# Altium schematic sheet Motor Driver.SchDoc
size A4; PageSetup: Record=PageOptions|CenterHorizontal=True|CenterVertical=True|PrintScale=0.98|XCorrection=1.00|YCorrection=1.00|PrintKind=2|BorderSize=5000000|LeftOffset=0|BottomOffset=0|Orientation=2|PaperLength=1000|PaperWidth=1000|Scale=100|PaperSource=7|PrintQuality=-4|MediaType=1|DitherType=10|PaperKind=A4|PrintScaleMode=1; DrawnBy: HENRIQUE THIESEN; Organization: Altium Limited; Address1: L3, 12a Rodborough Rd; Address2: Frenchs Forest; Address3: NSW; Address4: Australia 2086; DocumentNumber: 3; SheetNumber: 3; SheetTotal: 9; Project: WEG AirCon DAQ Adapter
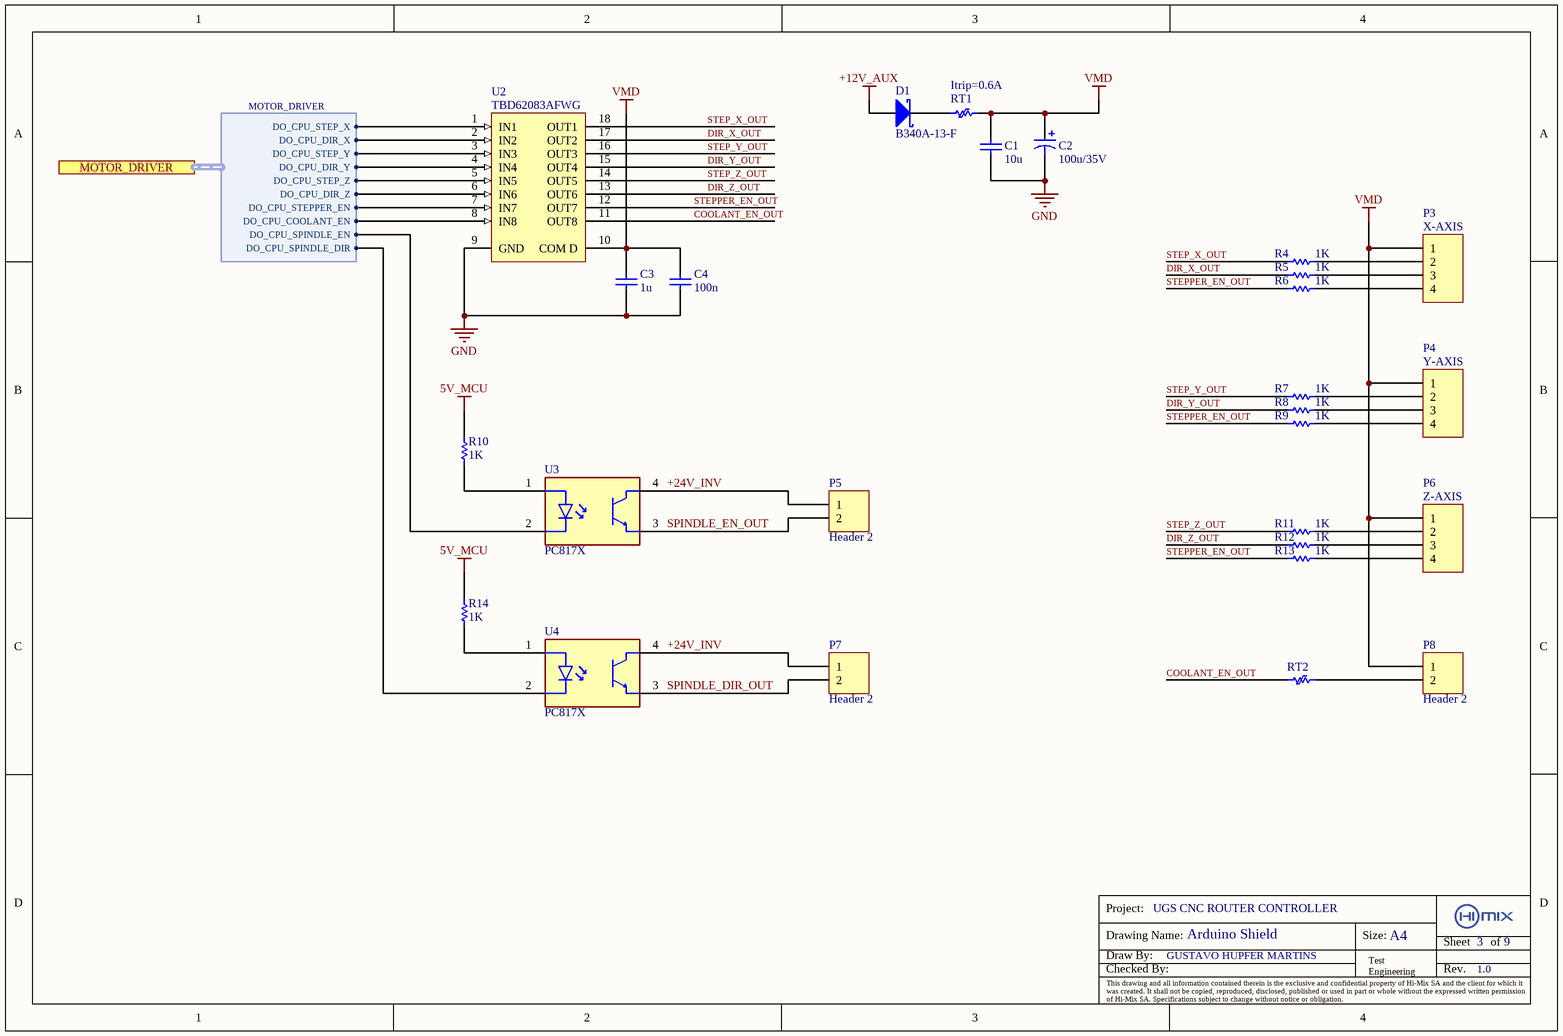
[diagram p0: Motor Driver.SchDoc]

## Parts
C1  value 10u  [SMT1210_M]  (hidden comment: X7R/1210/50V)
C2  value 100u/35V  [FKV Panasonic 8x10.2L (F)]  (hidden comment: 8x10.2)
C3  value 1u  [SMT0805_N]  (hidden comment: X7R/0805/50V)
C4  value 100n  [SMT0603_N]  (hidden comment: X7R/0603/50V)
D1  B340A-13-F  [SMB]
P3  Desc.: X-AXIS  [HDR1X4]
P4  Desc.: Y-AXIS  [HDR1X4]
P5  Header 2  [HDR1X2]
P6  Desc.: Z-AXIS  [HDR1X4]
P7  Header 2  [HDR1X2]
P8  Header 2  [HDR1X2]
R4  value 1K  [SMT1210_M]  (hidden comment: 1210/.5W/1Q)
R5  value 1K  [SMT1210_M]  (hidden comment: 1210/.5W/1Q)
R6  value 1K  [SMT1210_M]  (hidden comment: 1210/.5W/1Q)
R7  value 1K  [SMT1210_M]  (hidden comment: 1210/.5W/1Q)
R8  value 1K  [SMT1210_M]  (hidden comment: 1210/.5W/1Q)
R9  value 1K  [SMT1210_M]  (hidden comment: 1210/.5W/1Q)
R10  value 1K  [SMT1210_M]  (hidden comment: 1210/.5W/1Q)
R11  value 1K  [SMT1210_M]  (hidden comment: 1210/.5W/1Q)
R12  value 1K  [SMT1210_M]  (hidden comment: 1210/.5W/1Q)
R13  value 1K  [SMT1210_M]  (hidden comment: 1210/.5W/1Q)
R14  value 1K  [SMT1210_M]  (hidden comment: 1210/.5W/1Q)
RT1  Itrip=0.6A  [AXIAL-0.2]
RT2  Poly Switch  [AXIAL-0.2]  (value not drawn)
U2  TBD62083AFWG  [SOIC18]
U3  PC817X  [DIP-4]
U4  PC817X  [DIP-4]

## Ports
MOTOR_DRIVER (harness MOTOR_DRIVER)

## Harnesses
MOTOR_DRIVER: DO_CPU_STEP_X, DO_CPU_STEP_Y, DO_CPU_STEP_Z, DO_CPU_DIR_X, DO_CPU_DIR_Y, DO_CPU_DIR_Z, DO_CPU_STEPPER_EN, DO_CPU_COOLANT_EN, DO_CPU_SPINDLE_EN, DO_CPU_SPINDLE_DIR

## Nets
5V_MCU: R10.1 R14.1
+12V_AUX: D1.1(A)
GND: C1.1 C2.2 C3.1 C4.1 U2.9(GND)
VMD: C1.2 C2.1 C3.2 C4.2 P3.1 P4.1 P6.1 P8.1 RT1.1 U2.10(COM_D)
+24V_INV: P5.1 P7.1 U3.4(C) U4.4(C)
COOLANT_EN_OUT: RT2.1 U2.11(OUT8)
DIR_X_OUT: R5.1 U2.17(OUT2)
DIR_Y_OUT: R8.1 U2.15(OUT4)
DIR_Z_OUT: R12.1 U2.13(OUT6)
SPINDLE_DIR_OUT: P7.2 U4.3(E)
SPINDLE_EN_OUT: P5.2 U3.3(E)
STEP_X_OUT: R4.1 U2.18(OUT1)
STEP_Y_OUT: R7.1 U2.16(OUT3)
STEP_Z_OUT: R11.1 U2.14(OUT5)
STEPPER_EN_OUT: R6.1 R9.1 R13.1 U2.12(OUT7)
NetD1_2: D1.2(K) RT1.2
NetP3_2: P3.2 R4.2
NetP3_3: P3.3 R5.2
NetP3_4: P3.4 R6.2
NetP4_2: P4.2 R7.2
NetP4_3: P4.3 R8.2
NetP4_4: P4.4 R9.2
NetP6_2: P6.2 R11.2
NetP6_3: P6.3 R12.2
NetP6_4: P6.4 R13.2
NetP8_2: P8.2 RT2.2
NetR10_2: R10.2 U3.1(A)
NetR14_2: R14.2 U4.1(A)
NetU2_1: U2.1(IN1) ; port MOTOR_DRIVER.DO_CPU_STEP_X
NetU2_2: U2.2(IN2) ; port MOTOR_DRIVER.DO_CPU_DIR_X
NetU2_3: U2.3(IN3) ; port MOTOR_DRIVER.DO_CPU_STEP_Y
NetU2_4: U2.4(IN4) ; port MOTOR_DRIVER.DO_CPU_DIR_Y
NetU2_5: U2.5(IN5) ; port MOTOR_DRIVER.DO_CPU_STEP_Z
NetU2_6: U2.6(IN6) ; port MOTOR_DRIVER.DO_CPU_DIR_Z
NetU2_7: U2.7(IN7) ; port MOTOR_DRIVER.DO_CPU_STEPPER_EN
NetU2_8: U2.8(IN8) ; port MOTOR_DRIVER.DO_CPU_COOLANT_EN
NetU3_2: U3.2(K) ; port MOTOR_DRIVER.DO_CPU_SPINDLE_EN
NetU4_2: U4.2(K) ; port MOTOR_DRIVER.DO_CPU_SPINDLE_DIR

## Notes on the sheet
- UGS CNC ROUTER CONTROLLER
- GUSTAVO HUPFER MARTINS
- Arduino Shield
- 1.0
- Project:
- Drawing Name:
- Checked By:
- Draw By:
- Size:
- Test
  Engineering
- A4
- Sheet
- Rev.
- of
- This drawing and all information contained therein is the exclusive and confidential property of Hi-Mix SA and the client for which it was created. It shall not be copied, reproduced, disclosed, published or used in part or whole without the expressed written permission of Hi-Mix SA. Specifications subject to change without notice or obligation.

## Library data of the parts
C1 = Cap: Capacitor; PN: C3225X7S1H106K; MFT: TDK; Published: 8-Jun-2000; LatestRevisionDate: 17-Jul-2002; LatestRevisionNote: Re-released for DXP Platform.; PackageReference: RAD-0.3; Publisher: Altium Limited; PackageDescription: Radial Cap, Thru-Hole; 2 Leads; 0.3 in Pin Spacing
C2 = Cap Pol1: Polarized Capacitor (Radial); PN: EEEFP1V221AP; MFT: PANASONIC
C3 C4 = Cap: Capacitor; Published: 8-Jun-2000; LatestRevisionDate: 17-Jul-2002; LatestRevisionNote: Re-released for DXP Platform.; PackageReference: RAD-0.3; Publisher: Altium Limited; PackageDescription: Radial Cap, Thru-Hole; 2 Leads; 0.3 in Pin Spacing
D1 = D Schottky: Schottky Diode; MFT: DIODES; PN1: MBRA340T3G; MFT1: ON; PN: B340A-13-F
P3 P4 P6 = Header 4: Header, 4-Pin; LatestRevisionDate: 17-Jul-2002; LatestRevisionNote: Re-released for DXP Platform.; Publisher: Altium Limited
P5 P7 P8 = Header 2: Header, 2-Pin; LatestRevisionDate: 17-Jul-2002; LatestRevisionNote: Re-released for DXP Platform.; Publisher: Altium Limited
R4-R14 = Res1: Resistor; Published: 8-Jun-2000; LatestRevisionDate: 17-Jul-2002; LatestRevisionNote: Re-released for DXP Platform.; PackageReference: AXIAL-0.3; Publisher: Altium Limited; PackageDescription: Axial Device, Thru-Hole; 2 Leads; 0.3 in Pin Spacing
RT1 = Poly Switch: Thermistor; PN: RXEF030; MFT: BOURNS; Published: 24-Mar-1999; LatestRevisionDate: 29-May-2009; LatestRevisionNote: IPC-7351 Footprint Added.; PackageVersion: Mar-2003; PackageReference: 6-0805; Publisher: Altium Limited; PackageDescription: Chip Resistor 0805 Case Size; Code_IPC: RESC2012
RT2 = Poly Switch: Thermistor; Published: 24-Mar-1999; LatestRevisionDate: 29-May-2009; LatestRevisionNote: IPC-7351 Footprint Added.; PackageVersion: Mar-2003; PackageReference: 6-0805; Publisher: Altium Limited; PackageDescription: Chip Resistor 0805 Case Size; Code_IPC: RESC2012
U2 = ULN2803LW: High-Voltage, High-Current Darlington Array; MFT: TOSHIBA; PN: TBD62083AFWG; REF: https://br.mouser.com/ProductDetail/Toshiba/TBD62083AFWGEL?qs=fSnNYG2PaKJPpDBB6xK1QA%3D%3D